# EAGLE schematic nixie (EAGLE 6.5.0)
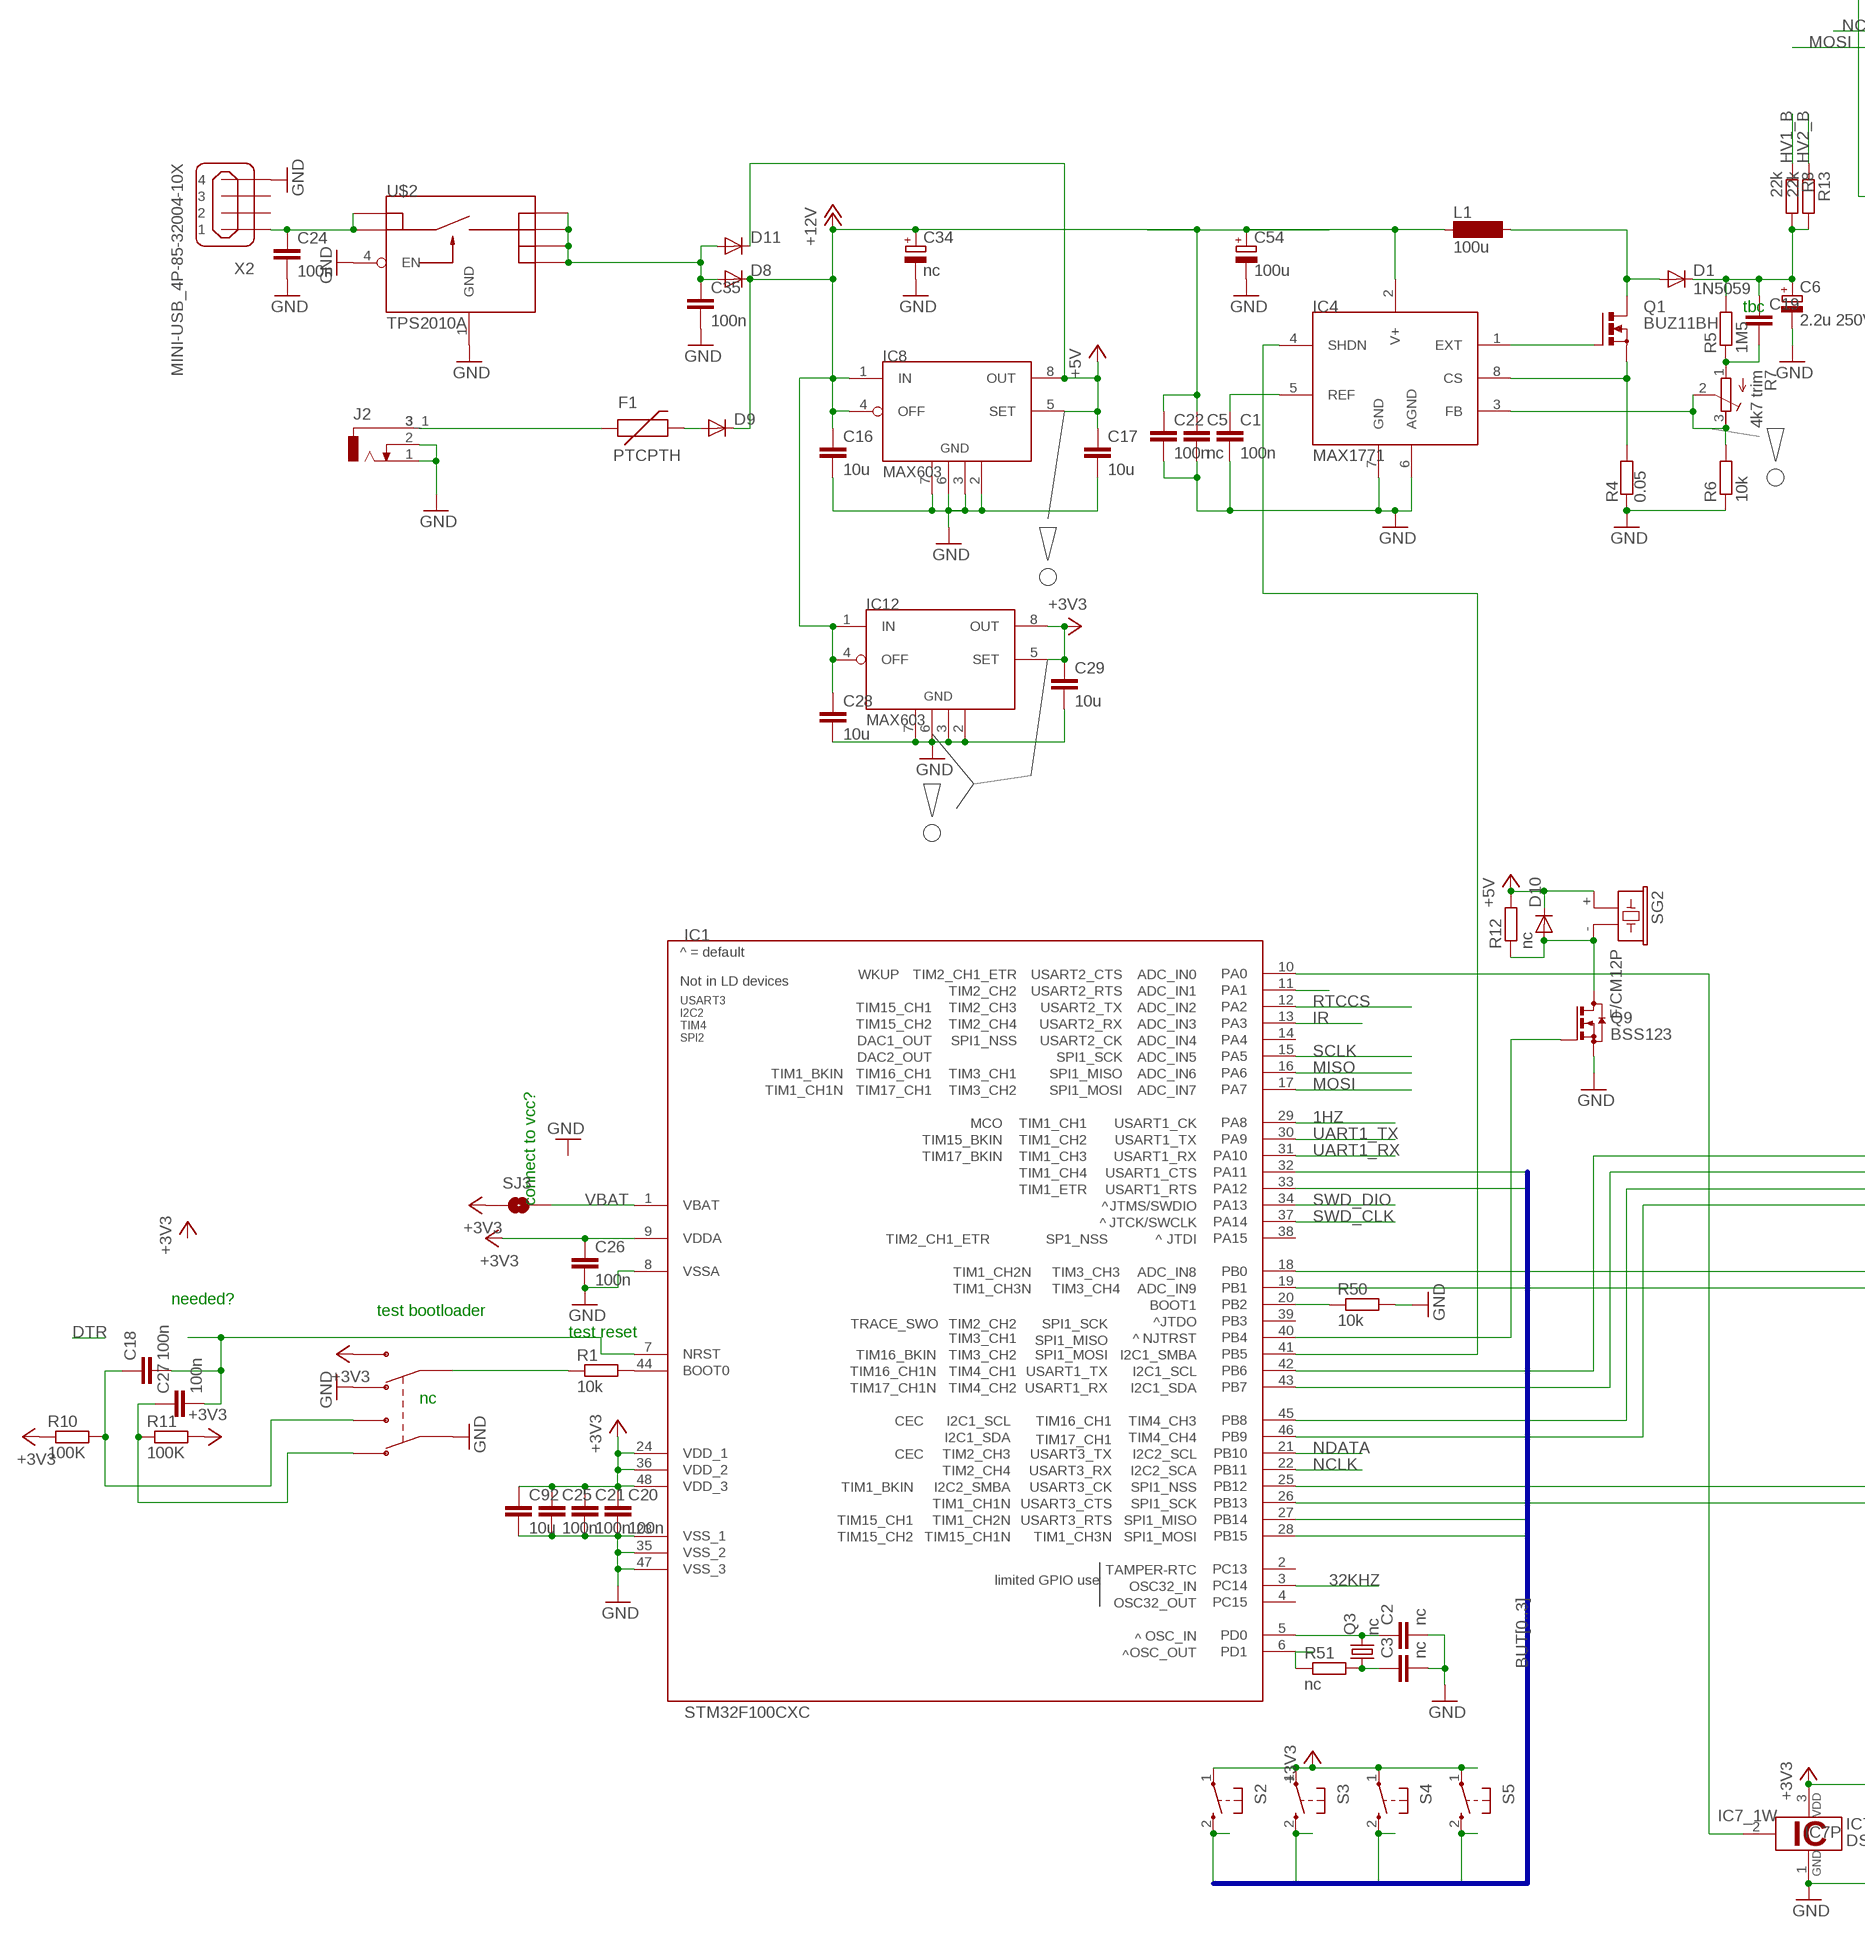
[diagram p0: schematic, sheet 1, part 1 of 3]
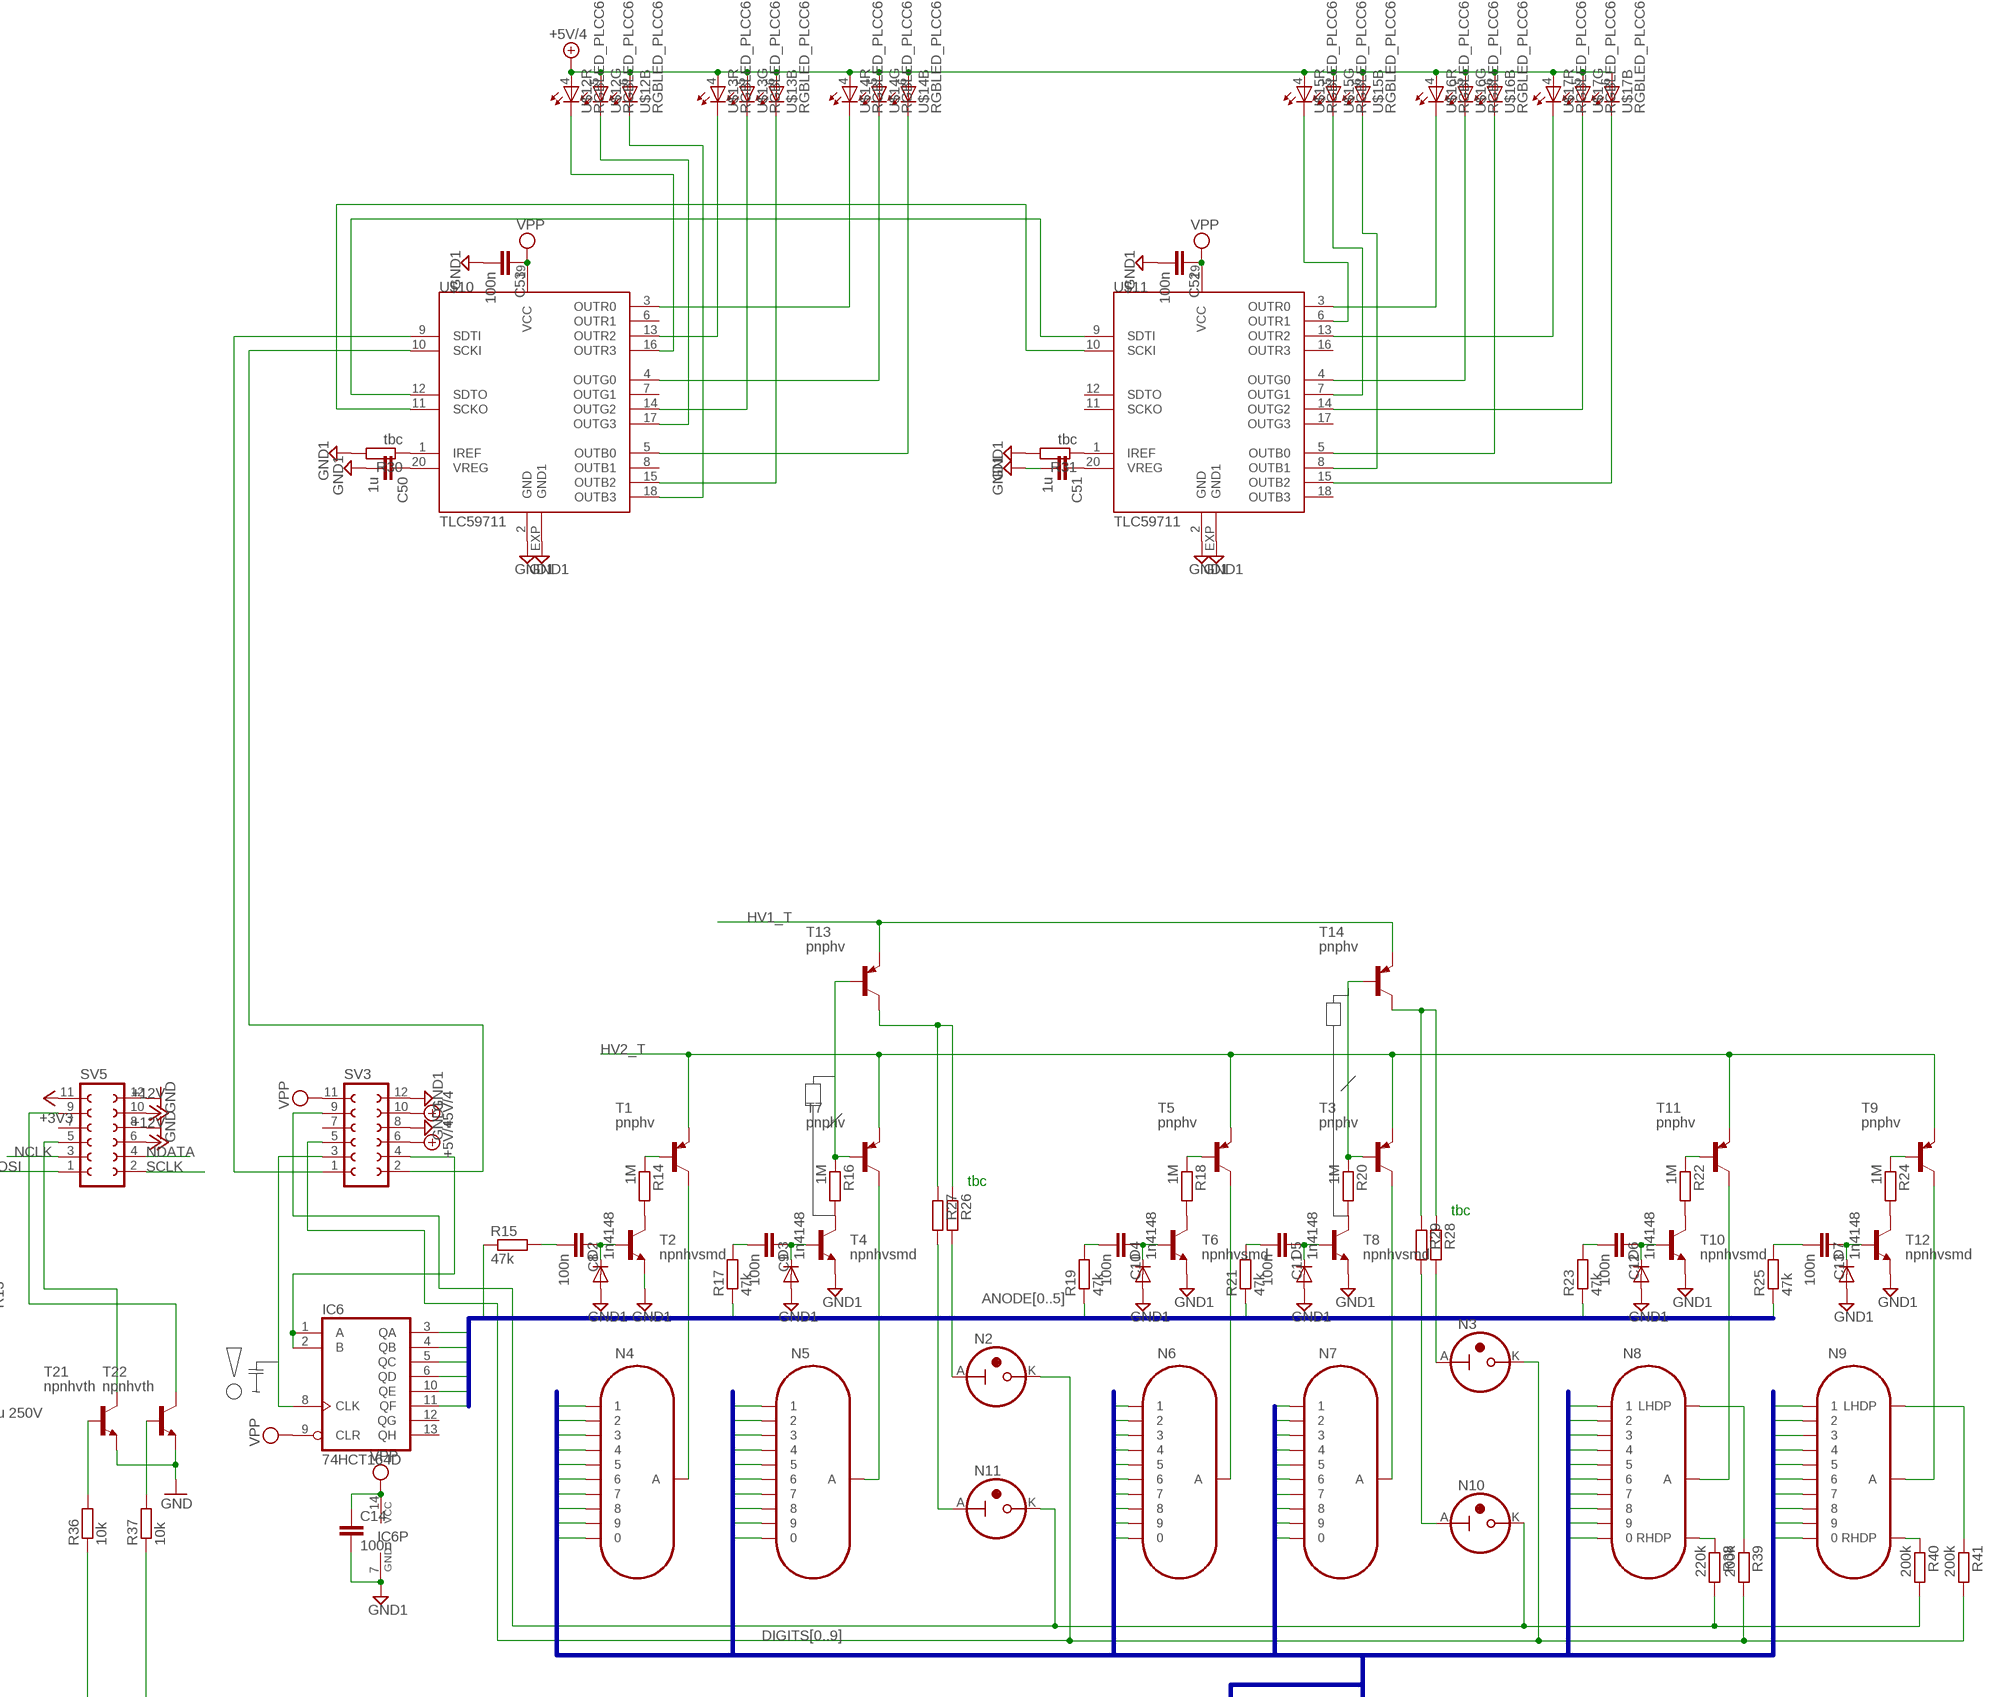
[diagram p1: schematic, sheet 1, part 2 of 3]
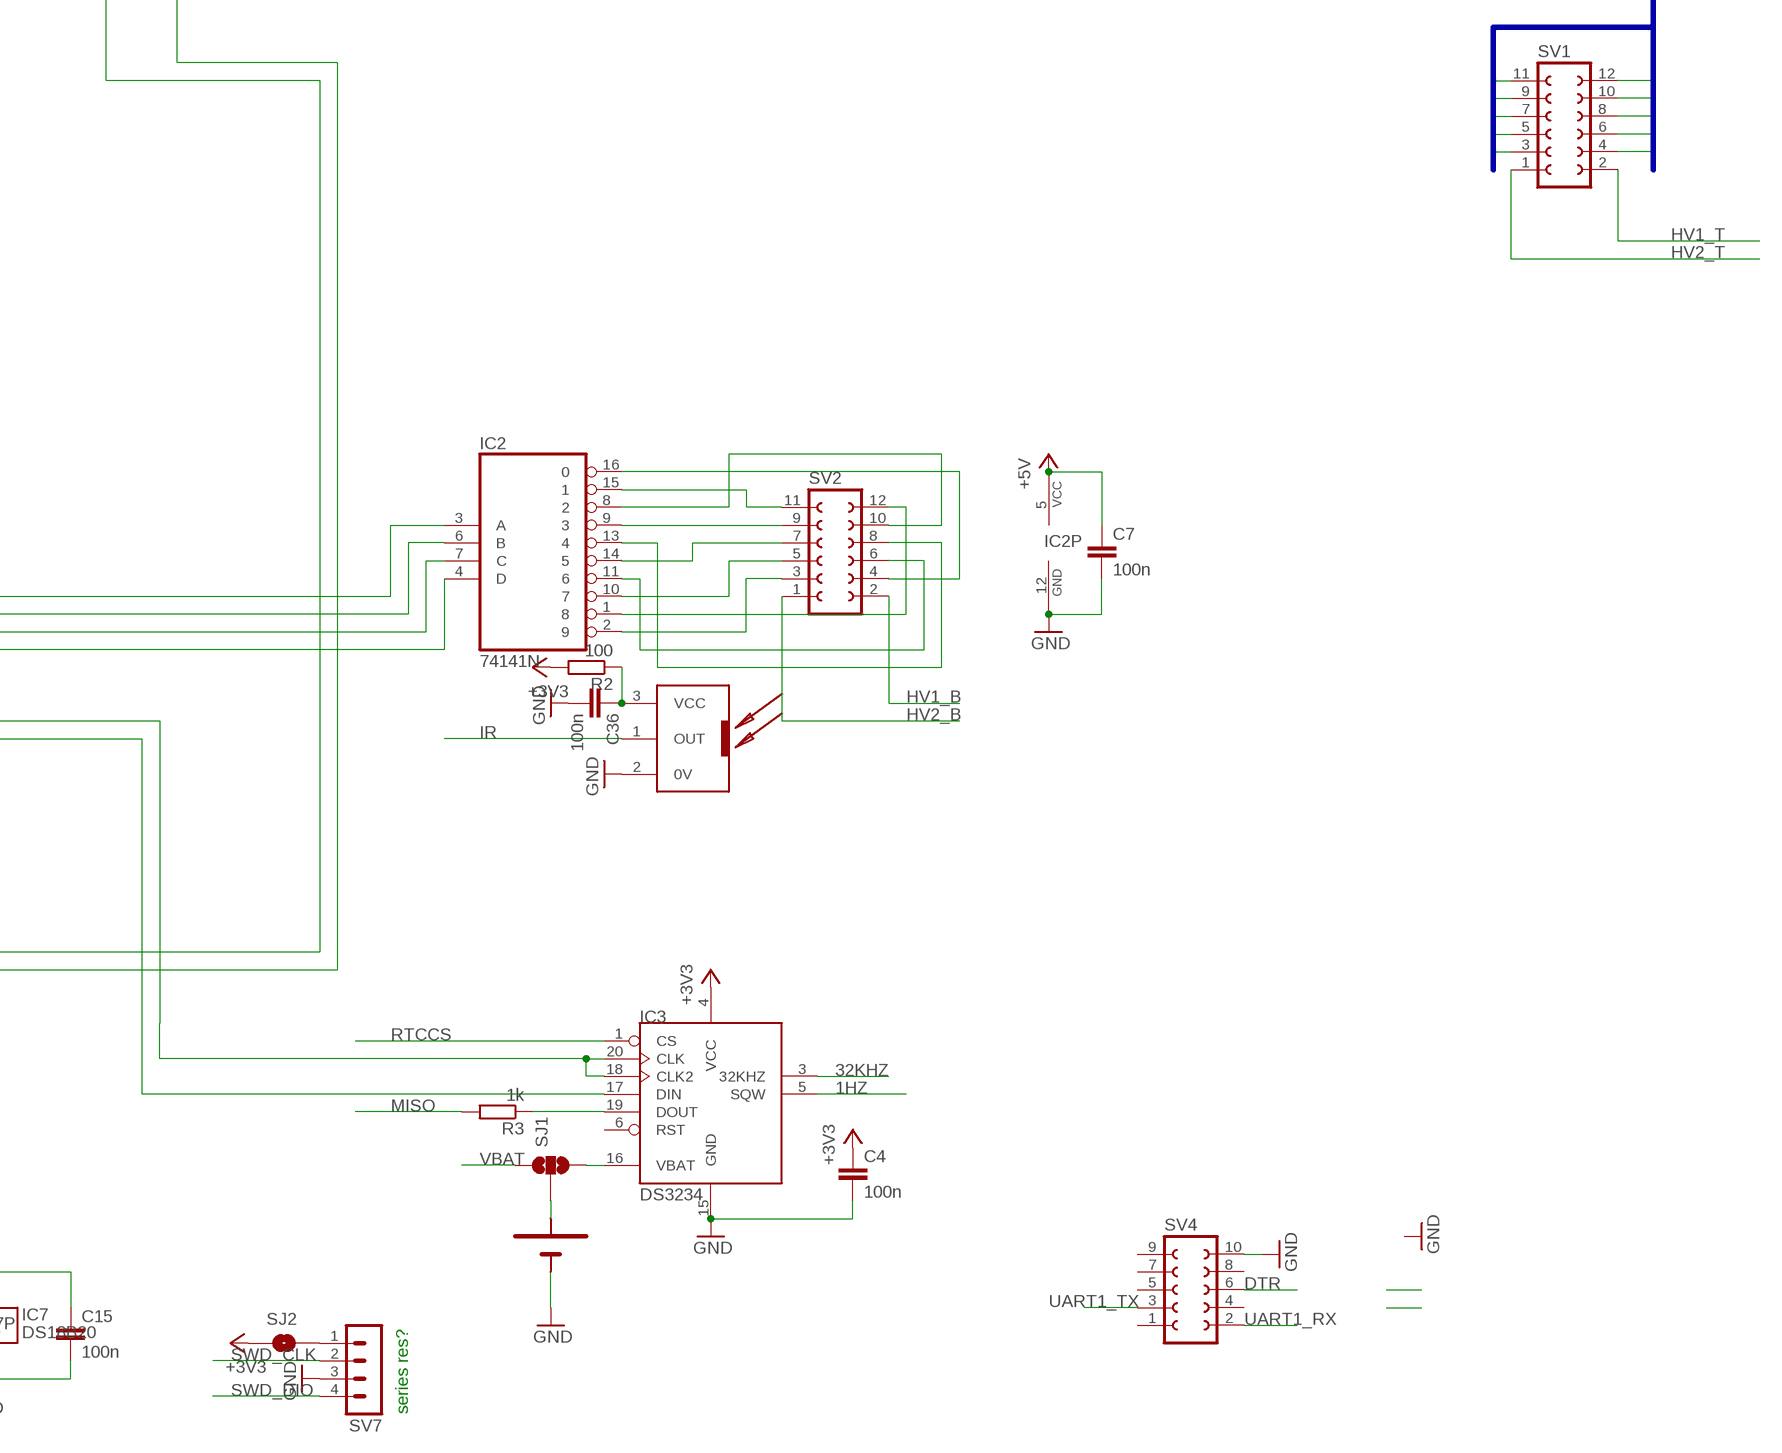
[diagram p2: schematic, sheet 1, part 3 of 3]

## Parts
BAT1  2032  [COIN]
C1  100n  C-EUC0603  [C0603]
C2  nc  C-EUC0603  [C0603]
C3  nc  C-EUC0603  [C0603]
C4  100n  C-EUC0603  [C0603]
C5  nc  C-EUC0603  [C0603]
C6  2.2u 250V  CPOL-EUE2.5-6  [E2,5-6]
C7  100n  C-EUC0603  [C0603]
C8  100n  C-EUC0603  [C0603]
C9  100n  C-EUC0603  [C0603]
C10  100n  C-EUC0603  [C0603]
C11  100n  C-EUC0603  [C0603]
C12  100n  C-EUC0603  [C0603]
C13  100n  C-EUC0603  [C0603]
C14  100n  C-EUC0603  [C0603]
C15  100n  C-EUC0603  [C0603]
C16  10u  C-EUC0603  [C0603]
C17  10u  C-EUC0603  [C0603]
C18  100n  C-EUC0603  [C0603]
C19  C-EUC0603  [C0603]
C20  100n  C-EUC0603  [C0603]
C21  100n  C-EUC0603  [C0603]
C22  100n  C-EUC0603  [C0603]
C24  100n  C-EUC0603  [C0603]
C25  100n  C-EUC0603  [C0603]
C26  100n  C-EUC0603  [C0603]
C27  100n  C-EUC0603  [C0603]
C28  10u  C-EUC0603  [C0603]
C29  10u  C-EUC0603  [C0603]
C34  nc  CPOL-EUSMCC  [SMC_C]
C35  100n  C-EUC0603  [C0603]
C36  100n  C-EUC0603  [C0603]
C50  1u  C-EUC0603  [C0603]
C51  1u  C-EUC0603  [C0603]
C52  100n  C-EUC0603  [C0603]
C53  100n  C-EUC0603  [C0603]
C54  100u  CPOL-EUE2.5-6  [E2,5-6]
C92  10u  C-EUC0603  [C0603]
D1  1N5059  DIODE-C1702-05  [C1702-05]
D2  1n4148  DIODESOD  [SOD-323]
D3  1n4148  DIODESOD  [SOD-323]
D4  1n4148  DIODESOD  [SOD-323]
D5  1n4148  DIODESOD  [SOD-323]
D6  1n4148  DIODESOD  [SOD-323]
D7  1n4148  DIODESOD  [SOD-323]
D8  DIODE-SOD123  [SOD123]
D9  DIODE-SOD123  [SOD123]
D10  DIODE-SOD123  [SOD123]
D11  DIODE-SOD123  [SOD123]
F1  PTCPTH  [PTC]
IC1  STM32F100CXC  [SQFP-S-7X7-48]
IC2  74141N  [DIL16]
IC3  DS3234  [SO20W]
IC4  MAX1771  [SO08]
IC6  74HCT164D  [SO14]
IC7  DS18B20  [TO92-]
IC8  MAX603  [SO08]
IC12  MAX603  [SO08]
J2  DCJ0303SMD  [SMD_JACK]
L1  100u  BS11  [BS11]
N2  IN-3  [IN-3]
N3  IN-3  [IN-3]
N4  IN-8  [IN-8]
N5  IN-8  [IN-8]
N6  IN-8  [IN-8]
N7  IN-8  [IN-8]
N8  IN-16  [IN-16]
N9  IN-16  [IN-16]
N10  IN-3  [IN-3]
N11  IN-3  [IN-3]
Q1  BUZ11BH  [TO220BH]
Q3  nc  CRYSTALCTS406  [CTS406]
Q9  BSS123  [SOT23]
R1  10k  R-EU_R0603  [R0603]
R2  100  R-EU_R0603  [R0603]
R3  1k  R-EU_R0603  [R0603]
R4  0.05  SMR-WAV  [SMS-WAV]
R5  1M5  R-EU_R0603  [R0603]
R6  10k  R-EU_R0603  [R0603]
R7  4k7 trim  R-TRIMM3314J  [RTRIM3314J]
R8  22k  R-EU_R0805  [R0805]
R10  100K  R-EU_R0603  [R0603]
R11  100K  R-EU_R0603  [R0603]
R12  nc  R-EU_R0603  [R0603]
R13  22k  R-EU_R0805  [R0805]
R14  1M  R-EU_R0603  [R0603]
R15  47k  R-EU_R0603  [R0603]
R16  1M  R-EU_R0603  [R0603]
R17  47k  R-EU_R0603  [R0603]
R18  1M  R-EU_R0603  [R0603]
R19  47k  R-EU_R0603  [R0603]
R20  1M  R-EU_R0603  [R0603]
R21  47k  R-EU_R0603  [R0603]
R22  1M  R-EU_R0603  [R0603]
R23  47k  R-EU_R0603  [R0603]
R24  1M  R-EU_R0603  [R0603]
R25  47k  R-EU_R0603  [R0603]
R26  R-EU_R0603  [R0603]
R27  R-EU_R0603  [R0603]
R28  R-EU_R0603  [R0603]
R29  R-EU_R0603  [R0603]
R30  tbc  R-EU_R0603  [R0603]
R31  tbc  R-EU_R0603  [R0603]
R36  10k  R-EU_R0603  [R0603]
R37  10k  R-EU_R0603  [R0603]
R38  220k  R-EU_R0603  [R0603]
R39  200k  R-EU_R0603  [R0603]
R40  200k  R-EU_R0603  [R0603]
R41  200k  R-EU_R0603  [R0603]
R50  10k  R-EU_R0603  [R0603]
R51  nc  R-EU_R0603  [R0603]
S2  TAC_SWITCH  [TACTSIDE]
S3  TAC_SWITCH  [TACTSIDE]
S4  TAC_SWITCH  [TACTSIDE]
S5  TAC_SWITCH  [TACTSIDE]
SG2  F/CM12P  [F/CM12P]
SJ1  SOLDERJUMPER_2WAYS  [SJ_3]
SJ2  SOLDERJUMPERNO  [SJ_2S-NO]
SJ3  SOLDERJUMPERNO  [SJ_2S-NO]
SV1  FE06-2  [FE06-2]
SV2  FE06-2  [FE06-2]
SV3  FE06-2  [FE06-2]
SV4  FE05-2WED  [EDGE_10]
SV5  FE06-2  [FE06-2]
SV7  MA04-1E  [EDGE_4]
T1  pnphv  BC807-16-PNP-SOT23-BEC  [SOT23-BEC]
T2  npnhvsmd  TRANSISTOR_NPNSOT23-3  [SOT23-3]
T3  pnphv  BC807-16-PNP-SOT23-BEC  [SOT23-BEC]
T4  npnhvsmd  TRANSISTOR_NPNSOT23-3  [SOT23-3]
T5  pnphv  BC807-16-PNP-SOT23-BEC  [SOT23-BEC]
T6  npnhvsmd  TRANSISTOR_NPNSOT23-3  [SOT23-3]
T7  pnphv  BC807-16-PNP-SOT23-BEC  [SOT23-BEC]
T8  npnhvsmd  TRANSISTOR_NPNSOT23-3  [SOT23-3]
T9  pnphv  BC807-16-PNP-SOT23-BEC  [SOT23-BEC]
T10  npnhvsmd  TRANSISTOR_NPNSOT23-3  [SOT23-3]
T11  pnphv  BC807-16-PNP-SOT23-BEC  [SOT23-BEC]
T12  npnhvsmd  TRANSISTOR_NPNSOT23-3  [SOT23-3]
T13  pnphv  BC807-16-PNP-SOT23-BEC  [SOT23-BEC]
T14  pnphv  BC807-16-PNP-SOT23-BEC  [SOT23-BEC]
T21  npnhvth  -NPN-TO92-EBC  [TO92-EBC]
T22  npnhvth  -NPN-TO92-EBC  [TO92-EBC]
U$1  IRREC  [IRREC]
U$2  TPS2010A  [SO-08]
U$3  DPDTSLIDE  [DPDTSLIDE]
U$10  TLC59711  [HTSSOP20PWP]
U$11  TLC59711  [HTSSOP20PWP]
U$12  RGBLED_PLCC6  [PLCC6]
U$13  RGBLED_PLCC6  [PLCC6]
U$14  RGBLED_PLCC6  [PLCC6]
U$15  RGBLED_PLCC6  [PLCC6]
U$16  RGBLED_PLCC6  [PLCC6]
U$17  RGBLED_PLCC6  [PLCC6]
X2  MINI-USB_4P-85-32004-10X  [85-32004-10X]

## Nets
1HZ: IC1.29(PA8) IC3.5(SQW)
32KHZ: IC1.3(PC14) IC3.3(32KHZ)
+3V3: C4.1 C15.1 C20.1 C21.1 C25.1 C26.1 C29.1 C92.1 IC1.9(VDDA) IC1.24(VDD_1) IC1.36(VDD_2) IC1.48(VDD_3) IC3.4(VCC) IC7.3 IC12.5(SET) IC12.8(OUT) R2.2 R10.1 R11.2 S2.1 S3.1 S4.1 S5.1 SJ2.1 SJ3.1 SV5.11 U$3.2B(NO1)
+5V: C7.1 C17.1 D10.C D11.C IC2.5(VCC) IC8.5(SET) IC8.8(OUT) R12.2 SG2.+
+5V/4: SV3.6 SV3.10 U$12.4(R:A) U$12.5(G:A) U$12.6(B:A) U$13.4(R:A) U$13.5(G:A) U$13.6(B:A) U$14.4(R:A) U$14.5(G:A) U$14.6(B:A) U$15.4(R:A) U$15.5(G:A) U$15.6(B:A) U$16.4(R:A) U$16.5(G:A) U$16.6(B:A) U$17.4(R:A) U$17.5(G:A) U$17.6(B:A)
+12V: C5.1 C16.1 C22.1 C28.1 C34.+ C54.+ D8.C D9.C IC4.2(V+) IC8.1(IN) IC8.4(OFF) IC12.1(IN) IC12.4(OFF) L1.1 SV5.6 SV5.10
ANODE0: IC6.3(QA) R15.1
ANODE1: IC6.4(QB) R17.1
ANODE2: IC6.5(QC) R19.1
ANODE3: IC6.6(QD) R21.1
ANODE4: IC6.10(QE) R23.1
ANODE5: IC6.11(QF) R25.1
BUT0: IC1.32(PA11) S5.2
BUT1: IC1.33(PA12) S2.2
BUT2: IC1.28(PB15) S4.2
BUT3: IC1.27(PB14) S3.2
DIGITS0: N4.0 N5.0 N6.0 N7.0 N8.0 N9.0 SV1.3
DIGITS1: N4.1 N5.1 N6.1 N7.1 N8.1 N9.1 SV1.12
DIGITS2: N4.2 N5.2 N6.2 N7.2 N8.2 N9.2 SV1.5
DIGITS3: N4.3 N5.3 N6.3 N7.3 N8.3 N9.3 SV1.6
DIGITS4: N4.4 N5.4 N6.4 N7.4 N8.4 N9.4 SV1.7
DIGITS5: N4.5 N5.5 N6.5 N7.5 N8.5 N9.5 SV1.8
DIGITS6: N4.6 N5.6 N6.6 N7.6 N8.6 N9.6 SV1.9
DIGITS7: N4.7 N5.7 N6.7 N7.7 N8.7 N9.7 SV1.10
DIGITS8: N4.8 N5.8 N6.8 N7.8 N8.8 N9.8 SV1.11
DIGITS9: N4.9 N5.9 N6.9 N7.9 N8.9 N9.9 SV1.4
DTR: SV4.6
GND: BAT1.- C1.2 C2.2 C3.2 C4.2 C5.2 C6.- C7.2 C15.2 C16.2 C17.2 C20.2 C21.2 C22.2 C24.2 C25.2 C26.2 C28.2 C29.2 C34.- C35.2 C36.2 C54.- C92.2 IC1.8(VSSA) IC1.23(VSS_1) IC1.35(VSS_2) IC1.47(VSS_3) IC2.12(GND) IC3.15(GND) IC4.6(AGND) IC4.7(GND) IC7.1 IC8.2(GND4) IC8.3(GND3) IC8.6(GND2) IC8.7(GND1) IC12.2(GND4) IC12.3(GND3) IC12.7(GND1) J2.1 J2.2 Q9.2(S) R4.2 R6.1 R50.2 SV4.10 SV5.8 SV5.12 SV7.3 T21.E T22.E U$1.2(0V) U$2.1(GND) U$2.4(EN) U$3.1X(COM0) U$3.2A(NC1) X2.4
GND1: C14.2 C50.2 C51.2 C52.2 C53.2 D2.2(A) D3.2(A) D4.2(A) D5.2(A) D6.2(A) D7.2(A) IC6.7(GND) R30.2 R31.2 SV3.8 SV3.12 T2.2(E) T4.2(E) T6.2(E) T8.2(E) T10.2(E) T12.2(E) U$10.2(GND) U$10.EXP(GND1) U$11.2(GND) U$11.EXP(GND1)
HV1_B: R8.1 SV2.2
HV1_T: SV1.2 T13.E T14.E
HV2_B: R13.1 SV2.1
HV2_T: SV1.1 T1.E T3.E T5.E T7.E T9.E T11.E
IR: IC1.13(PA3) U$1.1(OUT)
LED5: SV3.2 U$10.10(SCKI)
MISO: IC1.16(PA6) R3.2
MOSI: IC1.17(PA7) SV5.1
N$1: F1.P$1 J2.3 J2.3_1
N$2: IC6.1(A) IC6.2(B) SV3.4
N$3: BAT1.+ SJ1.2
N$4: IC1.25(PB12) R36.1
N$5: IC3.19(DOUT) R3.1
N$6: IC1.42(PB6) IC2.3(A)
N$7: IC3.16(VBAT) SJ1.3
N$8: IC1.19(PB1) IC3.17(DIN)
N$9: IC1.18(PB0) IC3.18(CLK2) IC3.20(CLK)
N$10: IC1.43(PB7) IC2.6(B)
N$11: IC1.45(PB8) IC2.7(C)
N$12: IC1.46(PB9) IC2.4(D)
N$13: IC4.1(EXT) Q1.G
N$14: IC4.8(CS) Q1.S R4.1
N$15: D1.A L1.2 Q1.D
N$16: N3.A R28.2
N$17: C1.1 IC4.5(REF)
N$18: R14.2 T2.3(C)
N$19: SV3.1 U$10.9(SDTI)
N$20: C19.2 R5.1 R7.1(E)
N$21: IC4.3(FB) R6.2 R7.2(S) R7.3(A)
N$22: R14.1 T1.B
N$23: C2.1 IC1.5(PD0) Q3.3
N$24: IC1.44(BOOT0) R1.2
N$25: N4.A T1.C
N$26: C6.+ C19.1 D1.C R5.2 R8.2 R13.2
N$27: C13.1 D7.1(C) T12.1(B)
N$28: N5.A T7.C
N$29: R16.2 T4.3(C)
N$30: R16.1 T7.B T13.B
N$31: C13.2 R25.2
N$32: N6.A T5.C
N$33: R18.2 T6.3(C)
N$34: R18.1 T5.B
N$35: C12.1 D6.1(C) T10.1(B)
N$36: R28.1 R29.1 T14.C
N$37: R20.2 T8.3(C)
N$38: R20.1 T3.B T14.B
N$39: C12.2 R23.2
N$40: N8.A T11.C
N$41: R22.2 T10.3(C)
N$42: R22.1 T11.B
N$43: C11.1 D5.1(C) T8.1(B)
N$44: N9.A T9.C
N$45: R24.2 T12.3(C)
N$46: R24.1 T9.B
N$47: C11.2 R21.2
N$48: IC1.6(PD1) R51.1
N$49: D9.A F1.P$2
N$50: IC1.11(PA1)
N$51: SJ2.2 SV7.1
N$52: IC1.40(PB4) Q9.1(G)
N$53: N2.A R26.2
N$54: N11.A R27.2
N$55: D10.A Q9.3(D) R12.1 SG2.-
N$56: N10.A R29.2
N$57: N10.K N11.K R38.2 R40.2 SV3.9
N$64: C24.1 U$2.2(IN1) U$2.3(IN2) X2.1
N$66: R37.2 T22.B
N$67: R36.2 T21.B
N$68: C18.2 C27.2 IC1.7(NRST)
N$69: C35.1 D8.A D11.A U$2.5(OUT1) U$2.6(OUT2) U$2.7(OUT3) U$2.8(OUT4)
N$71: C27.1 R11.1 U$3.1A(NC0)
N$73: C18.1 R10.2 U$3.1B(NO0)
N$74: IC1.26(PB13) R37.1
N$76: C10.1 D4.1(C) T6.1(B)
N$77: C10.2 R19.2
N$78: C9.1 D3.1(C) T4.1(B)
N$80: C9.2 R17.2
N$81: C8.1 D2.1(C) T2.1(B)
N$82: C8.2 R15.2
N$83: N8.RHDP R38.1
N$84: N8.LHDP R39.1
N$85: N9.RHDP R40.1
N$86: N9.LHDP R41.1
N$88: N2.K N3.K R39.2 R41.2 SV3.5
N$91: IC1.10(PA0) IC7.2
N$92: R26.1 R27.1 T13.C
N$94: IC2.16 SV2.4
N$95: N7.A T3.C
N$96: IC2.15 SV2.11
N$97: IC2.9 SV2.9
N$98: IC2.14 SV2.7
N$99: IC2.10 SV2.5
N$100: IC2.8 SV2.10
N$101: IC2.2 SV2.3
N$102: IC2.1 SV2.12
N$104: IC2.11 SV2.6
N$105: IC2.13 SV2.8
N$112: IC6.8(CLK) SV3.3
N$113: SV5.5 T21.C
N$114: SV5.9 T22.C
N$123: U$10.16(OUTR3) U$12.3(R:B)
N$125: U$10.13(OUTR2) U$13.3(R:B)
N$126: U$10.3(OUTR0) U$14.3(R:B)
N$127: U$10.17(OUTG3) U$12.2(G:B)
N$128: U$10.14(OUTG2) U$13.2(G:B)
N$129: IC1.41(PB5) IC4.4(SHDN)
N$130: U$10.4(OUTG0) U$14.2(G:B)
N$131: C36.1 R2.1 U$1.3(VCC)
N$132: U$10.18(OUTB3) U$12.1(B:B)
N$133: U$10.15(OUTB2) U$13.1(B:B)
N$134: U$10.5(OUTB0) U$14.1(B:B)
N$135: U$11.6(OUTR1) U$15.3(R:B)
N$136: U$11.3(OUTR0) U$16.3(R:B)
N$137: U$11.13(OUTR2) U$17.3(R:B)
N$138: U$11.7(OUTG1) U$15.2(G:B)
N$139: U$11.4(OUTG0) U$16.2(G:B)
N$140: U$11.14(OUTG2) U$17.2(G:B)
N$141: U$11.8(OUTB1) U$15.1(B:B)
N$142: U$11.5(OUTB0) U$16.1(B:B)
N$143: U$11.15(OUTB2) U$17.1(B:B)
N$144: C50.1 U$10.20(VREG)
N$145: R30.1 U$10.1(IREF)
N$146: C51.1 U$11.20(VREG)
N$147: R31.1 U$11.1(IREF)
N$148: U$10.12(SDTO) U$11.9(SDTI)
N$149: U$10.11(SCKO) U$11.10(SCKI)
N$182: R1.1 U$3.2X(COM1)
N$183: IC1.20(PB2) R50.1
N$184: C3.1 Q3.1 R51.2
NCLK: IC1.22(PB11) SV5.3
NDATA: IC1.21(PB10) SV5.4
RTCCS: IC1.12(PA2) IC3.1(CS)
SCLK: IC1.15(PA5) SV5.2
SWD_CLK: IC1.37(PA14) SV7.2
SWD_DIO: IC1.34(PA13) SV7.4
UART1_RX: IC1.31(PA10) SV4.2
UART1_TX: IC1.30(PA9) SV4.3
VBAT: IC1.1(VBAT) SJ1.1 SJ3.2
VPP: C14.1 C52.1 C53.1 IC6.9(CLR) IC6.14(VCC) SV3.11 U$10.19(VCC) U$11.19(VCC)
Unconnected: IC1.2(PC13) IC1.4(PC15) IC1.14(PA4) IC1.38(PA15) IC1.39(PB3) IC3.6(RST) IC6.12(QG) IC6.13(QH) SV3.7 SV4.1 SV4.4 SV4.5 SV4.7 SV4.8 SV4.9 SV5.7 U$10.6(OUTR1) U$10.7(OUTG1) U$10.8(OUTB1) U$11.11(SCKO) U$11.12(SDTO) U$11.16(OUTR3) U$11.17(OUTG3) U$11.18(OUTB3) X2.2 X2.3

## Buses
DIGITS[0..9]
ANODE[0..5]
BUT[0..3]

## Notes on the sheet
- tbc
- tbc
- tbc
- connect to vcc?
- needed? | test bootloader
- test reset
- nc
- series res?

## Power pins joined to a net without a drawn wire
GND2: IC12.6(GND2)

## Library data of the parts
BAT1 = Mine:2032
C1-C5 C7-C22 C24-C29 C35 C36 C50-C53 C92 = rcl:C-EU: CAPACITOR, European symbol
C6 C34 C54 = rcl:CPOL-EU: POLARIZED CAPACITOR, European symbol
D1 D8-D11 = diode:DIODE-: DIODE
D2-D7 = SparkFun:DIODE: Diode These are standard reverse protection diodes and small signal diodes. SMA package can handle up to about 1A. SOD-323 can handle about 200mA. What the SOD-323 package when ordering, there are some mfgs out there that are 5-pin packages.
F1 = SparkFun:PTC: Resettable Fuse PTC Resettable Fuse. Spark Fun Electronics SKU : COM-08357
IC1 = Mine:STM32F100CX
IC2 = 74xx-us:74*141: BCD to decimal DECODER/DRIVER
IC3 = Mine:DS3234
IC4 = Mine:MAX1771
IC6 = 74xx-eu:74*164: 8-bit parallel out SHIFT REGISTER
IC7 = 1wire:DS18B20: Programmable Resolution Digital Thermometer This chip provides a onewire thermosensor with approx. 0.5°C accuracy. A programmable over/undertemperure alarm is available. The precision can be set from 9..12 bits. Notes: Vdd must be applied for accurate measurements at low temperatures, as the parasite power circuit otherwise heats the sensor. If parasite power is used, Vdd has to be connected to GND. The DS1822 is a low-cost thermometer chip, the DS18S20 is similar to the DS18B20, but with 9 Bit precision only. Author: Jan Kandziora <jjj@gmx.de>
IC8 IC12 = Mine:MAX603
J2 = Mine:DCJ0303: DC POWER JACK Source: DCJ0303.pdf
L1 = inductor-neosid:BS: INDUCTOR nominal inductance, magnetically screened; OC_FARNELL: unknown; OC_NEWARK: unknown
N2 N3 N10 N11 = russian-nixies-mod:IN-3: IN-3: nixie bulb
N4-N7 = IN8:IN-8: IN-8: medium numeric frontview nixie tube
N8 N9 = russian-nixies:IN-16: IN-16: small numeric frontview nixie tube
Q1 = Mine:BUZ11: N-CHANNEL MOS FET
Q3 = crystal:CRYSTAL: CRYSTAL; OC_FARNELL: unknown; OC_NEWARK: unknown
Q9 = transistor-small-signal:BSS123: N-CHANNEL MOS FET
R1-R3 R5 R6 R8 R10-R31 R36-R41 R50 R51 = rcl:R-EU_: RESISTOR, European symbol
R4 = resistor-shunt:SMR-WAV: SMD SHUNT RESISTOR; OC_FARNELL: unknown; OC_NEWARK: unknown
R7 = rcl:R-TRIMM: Trimm resistor
S2-S5 = Mine:TAC_SWITCH: Momentary Switch Button commonly used for reset or general input. Spark Fun Electronics SKU : COM-00097
SG2 = buzzer:F/CM12P: BUZZER Source: Buerklin; OC_FARNELL: unknown; OC_NEWARK: unknown
SJ1 = SparkFun:SOLDERJUMPER_2WAY: Solder Jumper 2 way solder jumper
SJ2 SJ3 = SparkFun:SOLDERJUMPER: Solder Jumper Standard SMD solder jumper. Used to automate production. Two varients : Normally Open and Normally Closed are the same, but have different paste layers. NC will have a large amount of paste and should jumper during reflow.
SV1-SV3 SV5 = con-lsta:FE06-2: FEMALE HEADER; OC_FARNELL: unknown; OC_NEWARK: unknown
SV4 = Mine:FE05-2W: FEMALE HEADER
SV7 = Mine:MA04-1: PIN HEADER
T1 T3 T5 T7 T9 T11 T13 T14 = transistor:*-PNP-: PNP Transistror
T2 T4 T6 T8 T10 T12 = SparkFun:TRANSISTOR_NPN: Transistor NPN BJT configuration in SOT23 package. MMBT2222 is the common NPN we use. Double check BCE configuration again layout.
T21 T22 = transistor:*-NPN-: NPN Transistror BF959 corrected 2008.03.06
U$1 = Mine:IRREC
U$2 = Mine:TPS2010A
U$3 = Mine:DPDTSLIDE
U$10 U$11 = IN8:TLC59711
U$12-U$17 = IN8:RGBLED_PLCC6
X2 = con-cypressindustries:MINI-USB_4P-: MINI USB 4 Pol. Source: www.cypressindustries.com; OC_FARNELL: unknown; OC_NEWARK: unknown